# EasyEDA Pro project 2025-03-14.epro, schematic PCIex16_2
Board Name: PCIex16_2; Create Date: 2025-02-09; Page Name: PCIex16_2; Project Name: SXM2PCIE; Schematic Name: PCIex16_2; Update Date: 2025-03-11; Company: 嘉立创EDA; Page Size: A1; Version: V1.0
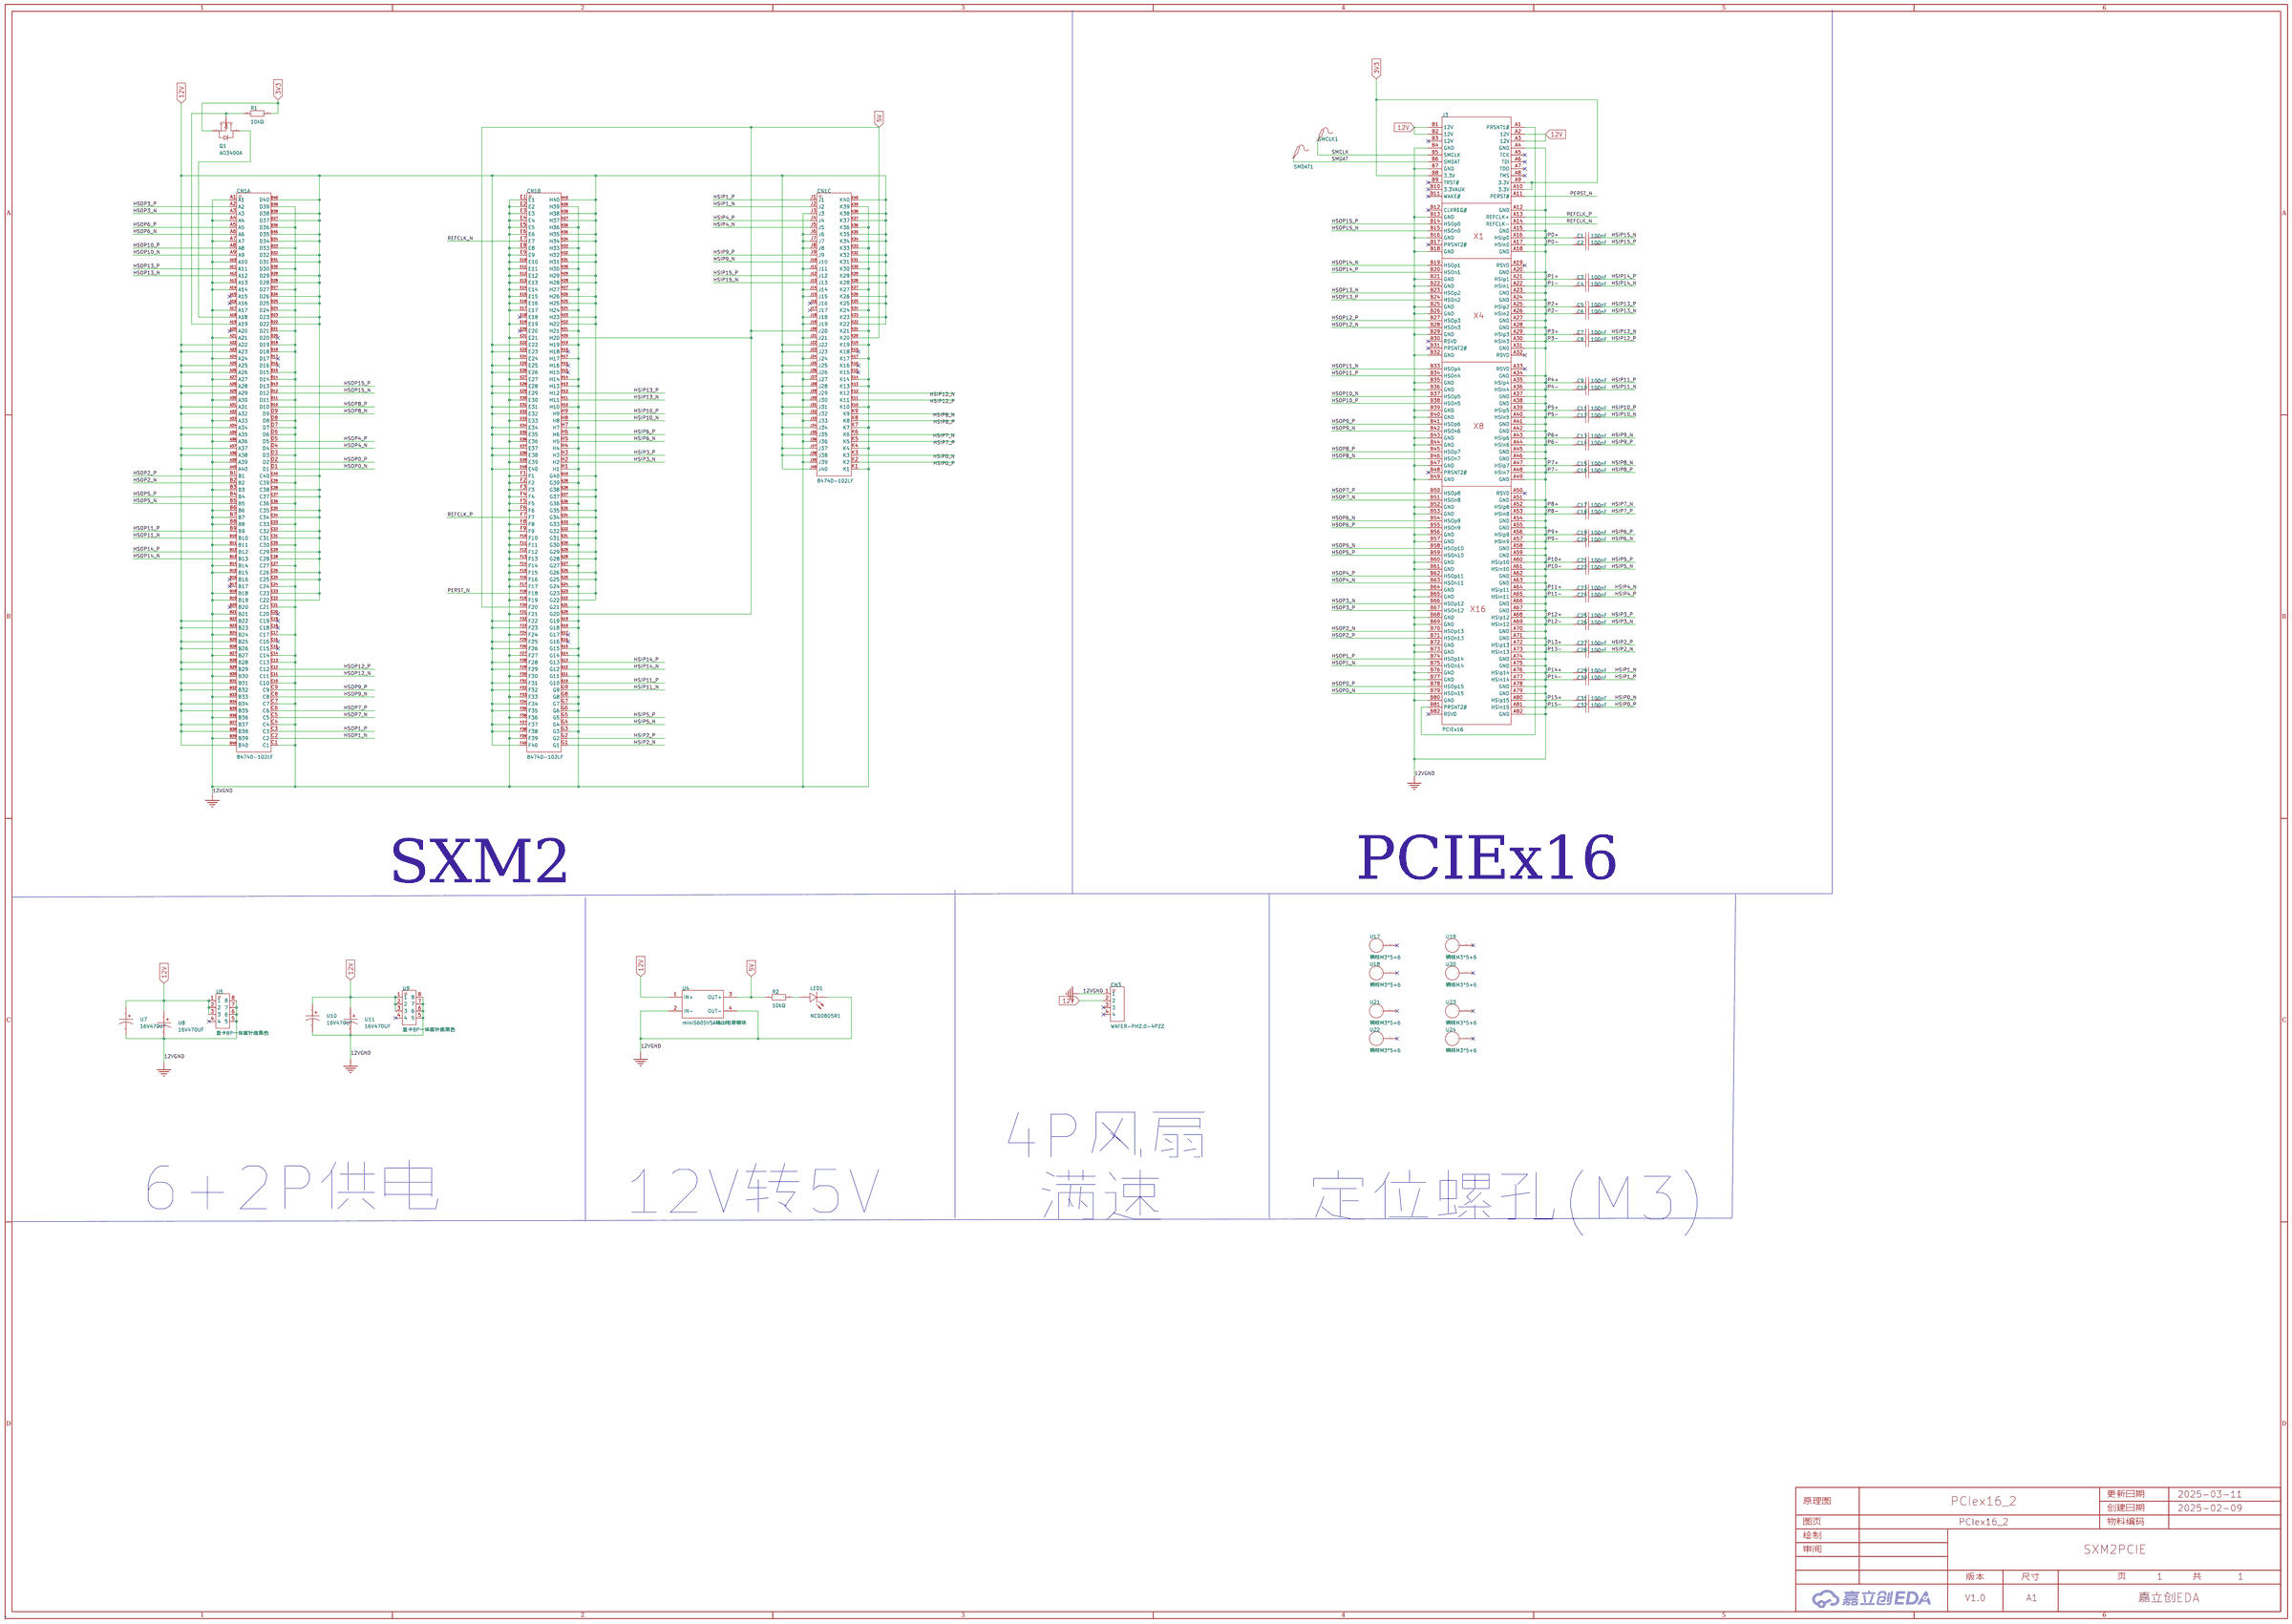
[diagram p0: schematic sheet]

## Parts
C1  100nF  [C0402]
C2  100nF  [C0402]
C3  100nF  [C0402]
C4  100nF  [C0402]
C5  100nF  [C0402]
C6  100nF  [C0402]
C7  100nF  [C0402]
C8  100nF  [C0402]
C9  100nF  [C0402]
C10  100nF  [C0402]
C11  100nF  [C0402]
C12  100nF  [C0402]
C13  100nF  [C0402]
C14  100nF  [C0402]
C15  100nF  [C0402]
C16  100nF  [C0402]
C17  100nF  [C0402]
C18  100nF  [C0402]
C19  100nF  [C0402]
C20  100nF  [C0402]
C21  100nF  [C0402]
C22  100nF  [C0402]
C23  100nF  [C0402]
C24  100nF  [C0402]
C25  100nF  [C0402]
C26  100nF  [C0402]
C27  100nF  [C0402]
C28  100nF  [C0402]
C29  100nF  [C0402]
C30  100nF  [C0402]
C31  100nF  [C0402]
C32  100nF  [C0402]
CN1  84740-102LF  [CONN-SMD_400P-P1.27_84740-002LF]  (sections 1,2,3)
CN3  WAFER-PH2.0-4PZZ  [CONN-TH_4P-P2.00_FWF20001-S04S22W5B]
J3  PCIEx16  [PCIEX16_金手指_有边框]  (no BOM)
LED1  NCD0805R1  [LED0805-R-RD]
Q1  AO3400A  [SOT-23-3_L2.9-W1.3-P1.90-LS2.4-BR]
R1  10kΩ  [R0402]
R2  10kΩ  [R0805]
SMCLK1  -  [Test-Point-0.5mm]
SMDAT1  -  [Test-Point-0.5mm]
U4  mini5605V5A输出电源模块  [COMM-SMD_MINI5605V5A]
U5  显卡8P一体直针座黑色  [CONN-TH_5557-2-4P]
U7  16V470UF  [CAP-SMD_BD8.0-L8.3-W8.3-LS9.3-FD]
U8  16V470UF  [CAP-SMD_BD8.0-L8.3-W8.3-LS9.3-FD]
U9  显卡8P一体直针座黑色  [CONN-TH_5557-2-4P]
U10  16V470UF  [CAP-SMD_BD8.0-L8.3-W8.3-LS9.3-FD]
U11  16V470UF  [CAP-SMD_BD8.0-L8.3-W8.3-LS9.3-FD]
U17  铜柱M3*5+6  [SMD_BD4.2-L4.7-W4.7-D3.0]
U18  铜柱M3*5+6  [SMD_BD4.2-L4.7-W4.7-D3.0]
U19  铜柱M3*5+6  [SMD_BD4.2-L4.7-W4.7-D3.0]
U20  铜柱M3*5+6  [SMD_BD4.2-L4.7-W4.7-D3.0]
U21  铜柱M3*5+6  [SMD_BD4.2-L4.7-W4.7-D3.0]
U22  铜柱M3*5+6  [SMD_BD4.2-L4.7-W4.7-D3.0]
U23  铜柱M3*5+6  [SMD_BD4.2-L4.7-W4.7-D3.0]
U24  铜柱M3*5+6  [SMD_BD4.2-L4.7-W4.7-D3.0]

## Library data of the parts
C1-C32 = CL05B104KO5NNNC: 容值:100nF;精度:±10%;额定电压:16V;材质(温度系数):X7R;; LCSC Part Name: 100nF ±10% 16V; Supplier Part: C1525; Manufacturer: SAMSUNG(三星); Supplier Footprint: 0402; JLCPCB Part Class: 基础库; Datasheet: https://atta.szlcsc.com/upload/public/pdf/source/20160218/1457707763339.pdf; Supplier: LCSC; Tolerance: ±10%; Voltage Rated: 16V; Temperature Coefficient: X7R
CN1 = 84740-102LF_C3645705: PIN总数:-;间距:1.27mm;安装方式:立贴;行数:10;; LCSC Part Name: 间距:1.27mm 公 立贴; Supplier Part: C3645705; Manufacturer: Amphenol; Supplier Footprint: SMD,P=1.27mm; JLCPCB Part Class: 扩展库; Supplier: LCSC; Pitch: 1.27mm; Mounting Style: 立贴; Number of Rows: 10; Contact Plating: 金
CN3 = WAFER-PH2.0-4PZZ: 插针结构:1x4P;间距:2mm;安装方式:直插;参考系列:PH;总PIN数:4P;排数:1;每排PIN数:4;行距:-;额定电流:2A;触头材质:黄铜;触头镀层:锡;工作温度:-25℃~+85℃;; LCSC Part Name: 1x4P 间距:2mm 直插 系列:PH; Supplier Part: C5359601; Manufacturer: XUNPU(讯普); Supplier Footprint: 插件,P=2mm; JLCPCB Part Class: 扩展库; Datasheet: https://atta.szlcsc.com/upload/public/pdf/source/20241108/09B74E94153224768C62B7F095CB8C18.pdf; Supplier: LCSC; Pins Structure: 1x4P; Pitch: 2mm; Mounting Type: 直插; Reference Series: PH; Number of Pins: 4P; Number of Rows: 1; Number of PINs Per Row: 4; Current Rating: 2A; Contact Material: 黄铜; Contact Plating: 锡; Operating Temperature: -25℃~+85℃; Voltage Rating: 250V; Plastic Material: PA66; Flame Retardant Rating: UL94V-0; Color: 白色; Z-Height of the Board: 6.05mm; X-Length of Bottom Edge on Board (Spacing Line): 10mm; Y-Width of Bottom Edge on Board: 4.7mm
J3 = PCIEX16_金手指_有边框
LED1 = NCD0805R1: 灯头类型:-;发光颜色:红色;正向电压(VF):1.6V~2.6V;功率:65mW;正向电流:20mA;主波长:615nm~630nm;二极管配置:独立二极管;透镜颜色:无色透明透镜;色温:-;发光强度:67mcd~195mcd;发光角度:130°;载带方式:-;工作温度:-30℃~+85℃;; Supplier Part: C84256; Manufacturer: 国星光电; Supplier Footprint: 0805; Datasheet: https://atta.szlcsc.com/upload/public/pdf/source/20200820/C84256_F0A75A43B3EAD75808600A0514C76B99.pdf; Supplier: LCSC; Emitted Color: 红色; Forward Voltage (VF): 1.6V~2.6V; Power Dissipation: 65mW; Forward Current: 20mA; Dominant Wavelength: 615nm~630nm; Diode Configuration: 独立二极管; Lens Color: 无色透明透镜; Luminous Intensity: 67mcd~195mcd; Viewing Angle: 130°; Operating Temperature: -30℃~+85℃
Q1 = AO3400A: 类型:1个N沟道;漏源电压(Vdss):30V;连续漏极电流(Id):5.2A;导通电阻(RDS(on)@Vgs,Id):27mΩ@4.5V,5A;功率(Pd):1W;阈值电压(Vgs(th)@Id):850mV@250uA;; LCSC Part Name: N沟道,电流:5.2A,耐压:30V; Supplier Part: C700953; Manufacturer: HUASHUO(华朔); Supplier Footprint: SOT-23; JLCPCB Part Class: 扩展库; Datasheet: https://atta.szlcsc.com/upload/public/pdf/source/20200713/C700953_2C399A25E2B0CA38CA8BE1B404780CC1.pdf; Supplier: LCSC; Type: 1个N沟道; Drain Source Voltage (Vdss): 30V; Continuous Drain Current (Id): 5.2A; Drain Source On Resistance (RDS(on)@Vgs,Id): 27mΩ@4.5V,5A; Power Dissipation (Pd): 1W; Gate Threshold Voltage (Vgs(th)@Id): 850mV@250uA; Total Gate Charge (Qg@Vgs): 11.7nC@4.5V; Input Capacitance (Ciss@Vds): 927pF@15V; Reverse Transfer Capacitance (Crss@Vds): 61pF@15V; Operating Temperature: -55℃~+150℃
R1 = 0402WGF1002TCE: 电阻类型:厚膜电阻;阻值:10kΩ;精度:±1%;功率:62.5mW;最大工作电压:50V;温度系数:±100ppm/℃;; LCSC Part Name: 10kΩ ±1% 62.5mW 厚膜电阻; Supplier Part: C25744; Manufacturer: UNI-ROYAL(厚声); Supplier Footprint: 0402; JLCPCB Part Class: 基础库; Datasheet: https://atta.szlcsc.com/upload/public/pdf/source/20200306/C422600_1E6D84923E4A46A82E41ADD87F860B5C.pdf; Supplier: LCSC; Type: 厚膜电阻; Tolerance: ±1%; Power(Watts): 62.5mW; Overload Voltage (Max): 50V; Temperature Coefficient: ±100ppm/℃; Operating Temperature Range: -55℃~+155℃
R2 = 0805W8F1002T5E_C17414: 电阻类型:厚膜电阻;阻值:10kΩ;精度:±1%;功率:125mW;最大工作电压:150V;温度系数:±100ppm/℃;; LCSC Part Name: 10kΩ ±1% 125mW 厚膜电阻; Supplier Part: C17414; Manufacturer: UNI-ROYAL(厚声); Manufacturer Part: 0805W8F1002T5E; Supplier Footprint: 0805; JLCPCB Part Class: 基础库; Datasheet: https://atta.szlcsc.com/upload/public/pdf/source/20200306/C422600_1E6D84923E4A46A82E41ADD87F860B5C.pdf; Supplier: LCSC; Type: 厚膜电阻; Tolerance: ±1%; Power(Watts): 125mW; Overload Voltage (Max): 150V; Temperature Coefficient: ±100ppm/℃; Operating Temperature Range: -55℃~+155℃
SMCLK1 SMDAT1 = Test-Point: Test Point 测试点
U4 = mini5605V5A输出电源模块: Supplier Part: C9900015474; Supplier Footprint: SMD; JLCPCB Part Class: 扩展库; Supplier: LCSC
U5 U9 = 显卡8P一体直针座黑色: Supplier Part: C9900011250; Supplier Footprint: 5557-2*4P-显卡; JLCPCB Part Class: 扩展库; Supplier: LCSC
U7 U8 U10 U11 = 16V470UF: Supplier Part: C9900014916; Supplier Footprint: 16V470UF-SMD; JLCPCB Part Class: 扩展库; Supplier: LCSC
U17-U24 = 铜柱M3*5+6: M3*5+6; LCSC Part Name: 国产 铜柱M3*5+6 铜柱M3*5+6; Supplier Part: C87703; Manufacturer: 国产; JLCPCB Part Class: 扩展库; Supplier: LCSC

## Nets
3V3: J3.A9(3.3V) J3.A10(3.3V) J3.B8(3.3V) Q1.2(S) R1.2
5V: CN1.F20 CN1.G20 CN1.H20 CN1.J20 CN1.K20 R2.1 U4.3(OUT+)
12V: CN1.A22 CN1.A23 CN1.A25 CN1.A26 CN1.A28 CN1.A29 CN1.A31 CN1.A32 CN1.A34 CN1.A35 CN1.A37 CN1.A38 CN1.A40 CN1.B22 CN1.B23 CN1.B25 CN1.B26 CN1.B28 CN1.B29 CN1.B31 CN1.B32 CN1.B34 CN1.B35 CN1.B37 CN1.B38 CN1.B40 CN1.C22 CN1.C23 CN1.C25 CN1.C26 CN1.C28 CN1.C29 CN1.C31 CN1.C32 CN1.C34 CN1.C35 CN1.C37 CN1.C38 CN1.C40 CN1.D22 CN1.D23 CN1.D25 CN1.D26 CN1.D28 CN1.D29 CN1.D31 CN1.D32 CN1.D34 CN1.D35 CN1.D37 CN1.D38 CN1.D40 CN1.E22 CN1.E23 CN1.E25 CN1.E26 CN1.E28 CN1.E29 CN1.E31 CN1.E32 CN1.E34 CN1.E35 CN1.E37 CN1.E38 CN1.E40 CN1.F22 CN1.F23 CN1.F25 CN1.F26 CN1.F28 CN1.F29 CN1.F31 CN1.F32 CN1.F34 CN1.F35 CN1.F37 CN1.F38 CN1.F40 CN1.G22 CN1.G23 CN1.G25 CN1.G26 CN1.G28 CN1.G29 CN1.G31 CN1.G32 CN1.G34 CN1.G35 CN1.G37 CN1.G38 CN1.G40 CN1.H22 CN1.H23 CN1.H25 CN1.H26 CN1.H28 CN1.H29 CN1.H31 CN1.H32 CN1.H34 CN1.H35 CN1.H37 CN1.H38 CN1.H40 CN1.J22 CN1.J23 CN1.J25 CN1.J26 CN1.J28 CN1.J29 CN1.J31 CN1.J32 CN1.J34 CN1.J35 CN1.J37 CN1.J38 CN1.J40 CN1.K22 CN1.K23 CN1.K25 CN1.K26 CN1.K28 CN1.K29 CN1.K31 CN1.K32 CN1.K34 CN1.K35 CN1.K37 CN1.K38 CN1.K40 CN3.2 J3.A2(12V) J3.A3(12V) J3.B1(12V) J3.B2(12V) U4.1(IN+) U5.1 U5.2 U5.3 U7.1 U8.1 U9.1 U9.2 U9.3 U10.1 U11.1
12VGND: CN1.A1 CN1.A4 CN1.A7 CN1.A10 CN1.A13 CN1.A14 CN1.A17 CN1.A21 CN1.A24 CN1.A27 CN1.A30 CN1.A33 CN1.A36 CN1.A39 CN1.B3 CN1.B6 CN1.B7 CN1.B8 CN1.B11 CN1.B14 CN1.B15 CN1.B18 CN1.B19 CN1.B21 CN1.B24 CN1.B27 CN1.B30 CN1.B33 CN1.B36 CN1.B39 CN1.C1 CN1.C4 CN1.C7 CN1.C10 CN1.C13 CN1.C14 CN1.C17 CN1.C21 CN1.C24 CN1.C27 CN1.C30 CN1.C33 CN1.C36 CN1.C39 CN1.D3 CN1.D6 CN1.D7 CN1.D8 CN1.D11 CN1.D14 CN1.D15 CN1.D18 CN1.D19 CN1.D21 CN1.D24 CN1.D27 CN1.D30 CN1.D33 CN1.D36 CN1.D39 CN1.E1 CN1.E2 CN1.E3 CN1.E4 CN1.E5 CN1.E6 CN1.E8 CN1.E9 CN1.E10 CN1.E11 CN1.E12 CN1.E13 CN1.E14 CN1.E15 CN1.E16 CN1.E17 CN1.E19 CN1.E21 CN1.E24 CN1.E27 CN1.E30 CN1.E33 CN1.E36 CN1.E39 CN1.F1 CN1.F2 CN1.F3 CN1.F4 CN1.F5 CN1.F6 CN1.F8 CN1.F9 CN1.F10 CN1.F11 CN1.F12 CN1.F13 CN1.F14 CN1.F15 CN1.F16 CN1.F17 CN1.F19 CN1.F21 CN1.F24 CN1.F27 CN1.F30 CN1.F33 CN1.F36 CN1.F39 CN1.G3 CN1.G6 CN1.G7 CN1.G8 CN1.G11 CN1.G14 CN1.G15 CN1.G18 CN1.G19 CN1.G21 CN1.G24 CN1.G27 CN1.G30 CN1.G33 CN1.G36 CN1.G39 CN1.H1 CN1.H4 CN1.H7 CN1.H10 CN1.H13 CN1.H14 CN1.H17 CN1.H19 CN1.H21 CN1.H24 CN1.H27 CN1.H30 CN1.H33 CN1.H36 CN1.H39 CN1.J3 CN1.J6 CN1.J7 CN1.J8 CN1.J11 CN1.J14 CN1.J15 CN1.J18 CN1.J19 CN1.J21 CN1.J24 CN1.J27 CN1.J30 CN1.J33 CN1.J36 CN1.J39 CN1.K1 CN1.K4 CN1.K7 CN1.K10 CN1.K13 CN1.K14 CN1.K17 CN1.K19 CN1.K21 CN1.K24 CN1.K27 CN1.K30 CN1.K33 CN1.K36 CN1.K39 CN3.1 J3.A4(GND) J3.A12(GND) J3.A15(GND) J3.A18(GND) J3.A20(GND) J3.A23(GND) J3.A24(GND) J3.A27(GND) J3.A28(GND) J3.A31(GND) J3.A34(GND) J3.A37(GND) J3.A38(GND) J3.A41(GND) J3.A42(GND) J3.A45(GND) J3.A46(GND) J3.A49(GND) J3.A51(GND) J3.A54(GND) J3.A55(GND) J3.A58(GND) J3.A59(GND) J3.A62(GND) J3.A63(GND) J3.A66(GND) J3.A67(GND) J3.A70(GND) J3.A71(GND) J3.A74(GND) J3.A75(GND) J3.A78(GND) J3.A79(GND) J3.A82(GND) J3.B4(GND) J3.B7(GND) J3.B13(GND) J3.B16(GND) J3.B18(GND) J3.B21(GND) J3.B22(GND) J3.B25(GND) J3.B26(GND) J3.B29(GND) J3.B32(GND) J3.B35(GND) J3.B36(GND) J3.B39(GND) J3.B40(GND) J3.B43(GND) J3.B44(GND) J3.B47(GND) J3.B49(GND) J3.B52(GND) J3.B53(GND) J3.B56(GND) J3.B57(GND) J3.B60(GND) J3.B61(GND) J3.B64(GND) J3.B65(GND) J3.B68(GND) J3.B69(GND) J3.B72(GND) J3.B73(GND) J3.B76(GND) J3.B77(GND) J3.B80(GND) LED1.2(-) U4.2(IN-) U4.4(OUT-) U5.5 U5.6 U5.7 U5.8 U7.2 U8.2 U9.5 U9.6 U9.7 U9.8 U10.2 U11.2
HSIP0_N: C31.2 CN1.K3
HSIP0_P: C32.2 CN1.K2
HSIP1_N: C29.2 CN1.J2
HSIP1_P: C30.2 CN1.J1
HSIP2_N: C28.2 CN1.G1
HSIP2_P: C27.2 CN1.G2
HSIP3_N: C26.2 CN1.H2
HSIP3_P: C25.2 CN1.H3
HSIP4_N: C23.2 CN1.J5
HSIP4_P: C24.2 CN1.J4
HSIP5_N: C22.2 CN1.G4
HSIP5_P: C21.2 CN1.G5
HSIP6_N: C20.2 CN1.H5
HSIP6_P: C19.2 CN1.H6
HSIP7_N: C17.2 CN1.K6
HSIP7_P: C18.2 CN1.K5
HSIP8_N: C15.2 CN1.K9
HSIP8_P: C16.2 CN1.K8
HSIP9_N: C13.2 CN1.J10
HSIP9_P: C14.2 CN1.J9
HSIP10_N: C12.2 CN1.H8
HSIP10_P: C11.2 CN1.H9
HSIP11_N: C10.2 CN1.G9
HSIP11_P: C9.2 CN1.G10
HSIP12_N: C7.2 CN1.K12
HSIP12_P: C8.2 CN1.K11
HSIP13_N: C6.2 CN1.H11
HSIP13_P: C5.2 CN1.H12
HSIP14_N: C4.2 CN1.G12
HSIP14_P: C3.2 CN1.G13
HSIP15_N: C1.2 CN1.J13
HSIP15_P: C2.2 CN1.J12
HSOP0_N: CN1.D1 J3.B79(HSOn15)
HSOP0_P: CN1.D2 J3.B78(HSOp15)
HSOP1_N: CN1.C2 J3.B75(HSOn14)
HSOP1_P: CN1.C3 J3.B74(HSOp14)
HSOP2_N: CN1.B2 J3.B70(HSOp13)
HSOP2_P: CN1.B1 J3.B71(HSOn13)
HSOP3_N: CN1.A3 J3.B66(HSOp12)
HSOP3_P: CN1.A2 J3.B67(HSOn12)
HSOP4_N: CN1.D4 J3.B63(HSOn11)
HSOP4_P: CN1.D5 J3.B62(HSOp11)
HSOP5_N: CN1.B5 J3.B58(HSOp10)
HSOP5_P: CN1.B4 J3.B59(HSOn10)
HSOP6_N: CN1.A6 J3.B54(HSOp9)
HSOP6_P: CN1.A5 J3.B55(HSOn9)
HSOP7_N: CN1.C5 J3.B51(HSOn8)
HSOP7_P: CN1.C6 J3.B50(HSOp8)
HSOP8_N: CN1.D9 J3.B46(HSOn7)
HSOP8_P: CN1.D10 J3.B45(HSOp7)
HSOP9_N: CN1.C8 J3.B42(HSOn6)
HSOP9_P: CN1.C9 J3.B41(HSOp6)
HSOP10_N: CN1.A9 J3.B37(HSOp5)
HSOP10_P: CN1.A8 J3.B38(HSOn5)
HSOP11_N: CN1.B10 J3.B33(HSOp4)
HSOP11_P: CN1.B9 J3.B34(HSOn4)
HSOP12_N: CN1.C11 J3.B28(HSOn3)
HSOP12_P: CN1.C12 J3.B27(HSOp3)
HSOP13_N: CN1.A12 J3.B23(HSOp2)
HSOP13_P: CN1.A11 J3.B24(HSOn2)
HSOP14_N: CN1.B13 J3.B19(HSOp1)
HSOP14_P: CN1.B12 J3.B20(HSOn1)
HSOP15_N: CN1.D12 J3.B15(HSOn0)
HSOP15_P: CN1.D13 J3.B14(HSOp0)
IP0+: C1.1 J3.A16(HSIp0)
IP0-: C2.1 J3.A17(HSIn0)
IP1+: C3.1 J3.A21(HSIp1)
IP1-: C4.1 J3.A22(HSIn1)
IP2+: C5.1 J3.A25(HSIp2)
IP2-: C6.1 J3.A26(HSIn2)
IP3+: C7.1 J3.A29(HSIp3)
IP3-: C8.1 J3.A30(HSIn3)
IP4+: C9.1 J3.A35(HSIp4)
IP4-: C10.1 J3.A36(HSIn4)
IP5+: C11.1 J3.A39(HSIp5)
IP5-: C12.1 J3.A40(HSIn5)
IP6+: C13.1 J3.A43(HSIp6)
IP6-: C14.1 J3.A44(HSIn6)
IP7+: C15.1 J3.A47(HSIp7)
IP7-: C16.1 J3.A48(HSIn7)
IP8+: C17.1 J3.A52(HSIp8)
IP8-: C18.1 J3.A53(HSIn8)
IP9+: C19.1 J3.A56(HSIp9)
IP9-: C20.1 J3.A57(HSIn9)
IP10+: C21.1 J3.A60(HSIp10)
IP10-: C22.1 J3.A61(HSIn10)
IP11+: C23.1 J3.A64(HSIp11)
IP11-: C24.1 J3.A65(HSIn11)
IP12+: C25.1 J3.A68(HSIp12)
IP12-: C26.1 J3.A69(HSIn12)
IP13+: C27.1 J3.A72(HSIp13)
IP13-: C28.1 J3.A73(HSIn13)
IP14+: C29.1 J3.A76(HSIp14)
IP14-: C30.1 J3.A77(HSIn14)
IP15+: C31.1 J3.A80(HSIp15)
IP15-: C32.1 J3.A81(HSIn15)
PERST_N: CN1.F18 J3.A11(PERST#)
REFCLK_N: CN1.E7 J3.A14(REFCLK-)
REFCLK_P: CN1.F7 J3.A13(REFCLK+)
SMCLK: J3.B5(SMCLK) SMCLK1.1
SMDAT: J3.B6(SMDAT) SMDAT1.1
$1N101473: J3.A1(PRSNT1#) J3.B81(PRSNT2#)
$1N108562: CN1.A19 Q1.1(G) R1.1
$1N108568: CN1.A18 Q1.3(D)
$1N129529: LED1.1(+) R2.2

Not connected (* = marked no-connect by the designer): CN1 A15* A16* A20* B16* B17* B20* C15* C16* C18* C19* C20* D16* D17* D20* E18* E20* G16* G17* H15* H16* H18* J16* J17* K15* K16* K18*; CN3 3* 4*; J3 A5(TCK)* A6(TDI)* A7(TDO)* A8(TMS)* A19(RSVD)* A32(RSVD)* A33(RSVD)* A50(RSVD)* B3(12V)* B9(TRST#)* B10(3.3VAUX)* B11(WAKE#)* B12(CLKREQ#)* B17(PRSNT2#)* B30(RSVD)* B31(PRSNT2#)* B48(PRSNT2#)* B82(RSVD)*; U5 4*; U9 4*; U17 1*; U18 1*; U19 1*; U20 1*; U21 1*; U22 1*; U23 1*; U24 1*

## Notes on the sheet
- PCIEx16
- SXM2
- 4P风扇
- 6+2P供电
- 12V转5V
- 满速
- 定位螺孔(M3)
